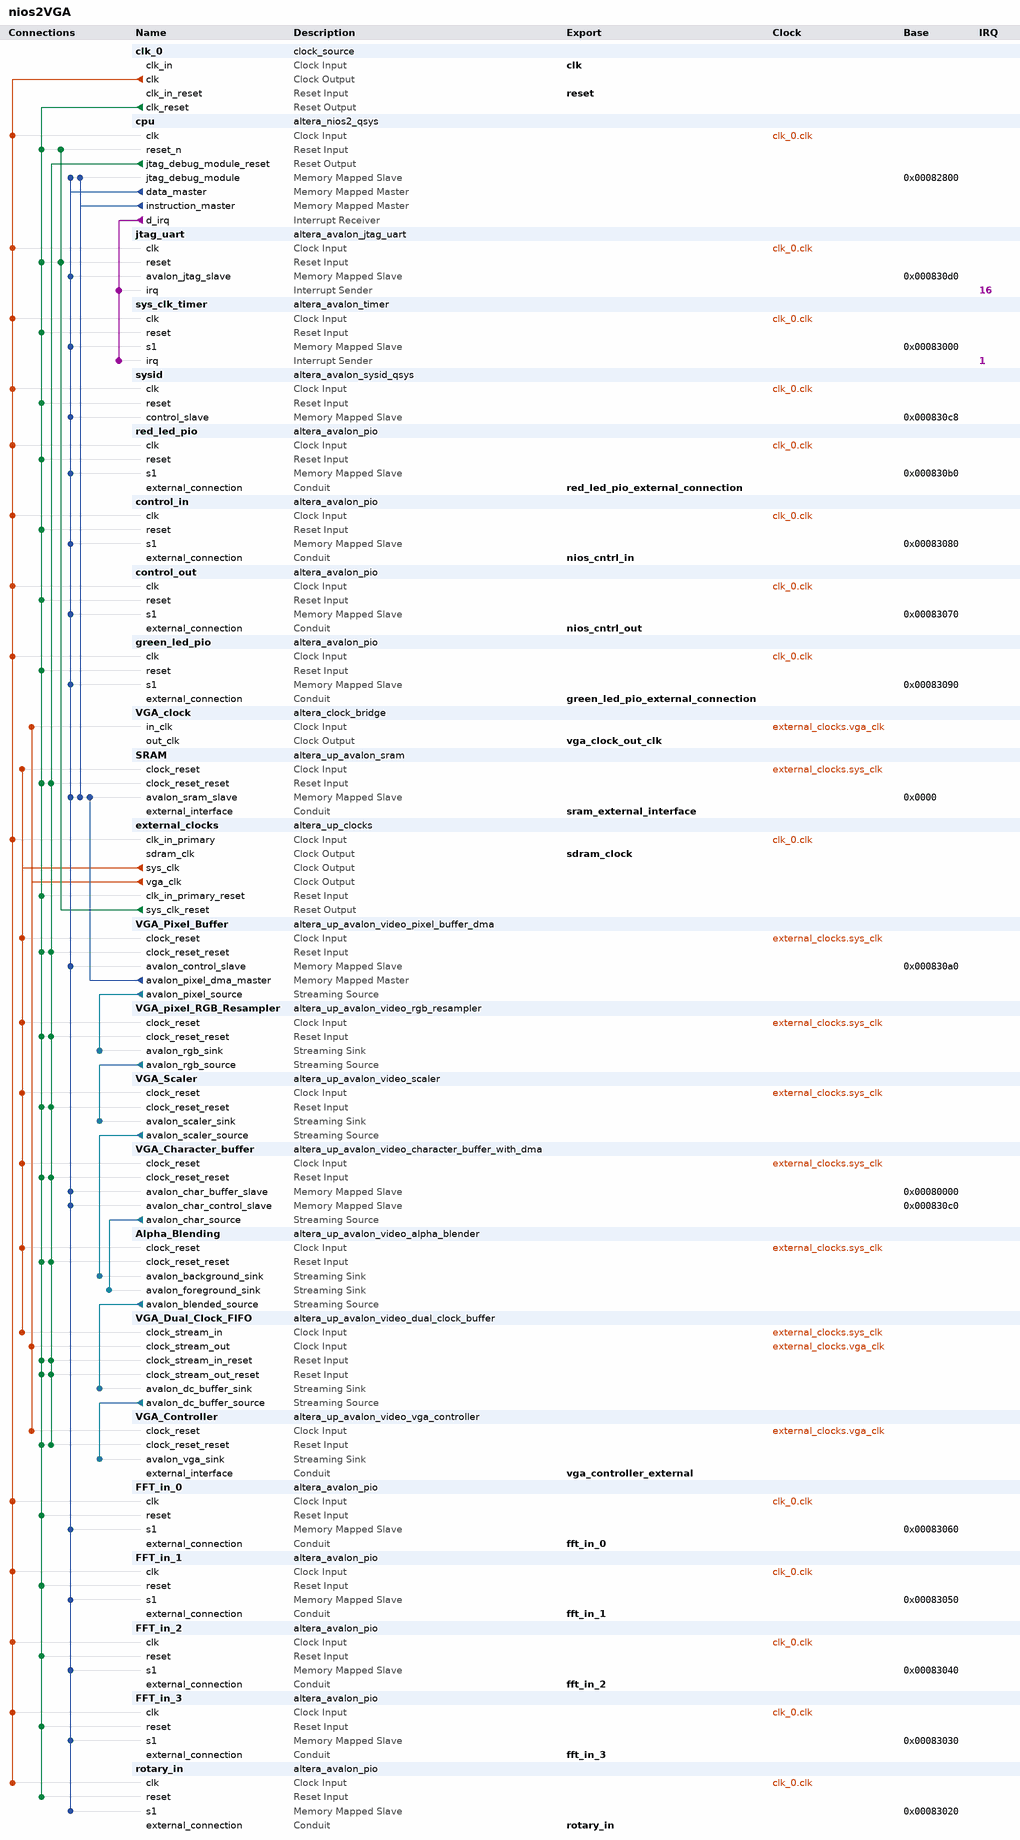
[diagram p0: system contents]
# Platform Designer (Qsys) system nios2VGA, Cyclone II EP2C35F672C6
# Parameters at their usual value, and those the tool derives, are not listed.
package require -exact qsys 13.0.1.99.2
create_system nios2VGA
set_project_property DEVICE_FAMILY {Cyclone II}
set_project_property DEVICE EP2C35F672C6

add_instance clk_0 clock_source 13.0
set_instance_parameter_value clk_0 clockFrequency 200000000

add_instance cpu altera_nios2_qsys 13.0
set_instance_parameter_value cpu resetOffset 307200
set_instance_parameter_value cpu exceptionOffset 307232
set_instance_parameter_value cpu resetSlave SRAM.avalon_sram_slave
set_instance_parameter_value cpu mmu_TLBMissExcSlave None
set_instance_parameter_value cpu exceptionSlave SRAM.avalon_sram_slave
set_instance_parameter_value cpu breakSlave cpu.jtag_debug_module
set_instance_parameter_value cpu muldiv_multiplierType NoneSmall
set_instance_parameter_value cpu impl Tiny
set_instance_parameter_value cpu icache_size 2048

add_instance jtag_uart altera_avalon_jtag_uart 13.0.1.99.2
set_instance_parameter_value jtag_uart simInteractiveOptions NO_INTERACTIVE_WINDOWS

add_instance sys_clk_timer altera_avalon_timer 13.0.1.99.2
set_instance_parameter_value sys_clk_timer period 1
set_instance_parameter_value sys_clk_timer periodUnits MSEC

add_instance sysid altera_avalon_sysid_qsys 13.0
set_instance_parameter_value sysid id 0

add_instance red_led_pio altera_avalon_pio 13.0.1.99.2
set_instance_parameter_value red_led_pio direction Output
set_instance_parameter_value red_led_pio width 18

add_instance control_in altera_avalon_pio 13.0.1.99.2
set_instance_parameter_value control_in direction Input
set_instance_parameter_value control_in width 8

add_instance control_out altera_avalon_pio 13.0.1.99.2
set_instance_parameter_value control_out direction Output
set_instance_parameter_value control_out width 8

add_instance green_led_pio altera_avalon_pio 13.0.1.99.2
set_instance_parameter_value green_led_pio direction Output
set_instance_parameter_value green_led_pio width 9

add_instance VGA_clock altera_clock_bridge 13.0
set_instance_parameter_value VGA_clock DERIVED_CLOCK_RATE 25000000
set_instance_parameter_value VGA_clock EXPLICIT_CLOCK_RATE 0

add_instance SRAM altera_up_avalon_sram 12.0
set_instance_parameter_value SRAM board DE2
set_instance_parameter_value SRAM pixel_buffer true

add_instance external_clocks altera_up_clocks 12.0
set_instance_parameter_value external_clocks board DE2
set_instance_parameter_value external_clocks vga_clk true
set_instance_parameter_value external_clocks audio_clk false
set_instance_parameter_value external_clocks audio_clk_freq 12.288

add_instance VGA_Pixel_Buffer altera_up_avalon_video_pixel_buffer_dma 12.0
set_instance_parameter_value VGA_Pixel_Buffer addr_mode Consecutive
set_instance_parameter_value VGA_Pixel_Buffer start_address 0
set_instance_parameter_value VGA_Pixel_Buffer back_start_address 153600
set_instance_parameter_value VGA_Pixel_Buffer image_width 320
set_instance_parameter_value VGA_Pixel_Buffer image_height 240
set_instance_parameter_value VGA_Pixel_Buffer color_space {16-bit RGB}

add_instance VGA_pixel_RGB_Resampler altera_up_avalon_video_rgb_resampler 12.0
set_instance_parameter_value VGA_pixel_RGB_Resampler input_type {16-bit RGB}
set_instance_parameter_value VGA_pixel_RGB_Resampler output_type {30-bit RGB}
set_instance_parameter_value VGA_pixel_RGB_Resampler alpha 1023

add_instance VGA_Scaler altera_up_avalon_video_scaler 12.0
set_instance_parameter_value VGA_Scaler width_scaling 2
set_instance_parameter_value VGA_Scaler height_scaling 2
set_instance_parameter_value VGA_Scaler width_in 320
set_instance_parameter_value VGA_Scaler color_bits 10
set_instance_parameter_value VGA_Scaler color_planes 3

add_instance VGA_Character_buffer altera_up_avalon_video_character_buffer_with_dma 12.0
set_instance_parameter_value VGA_Character_buffer enable_transparency true

add_instance Alpha_Blending altera_up_avalon_video_alpha_blender 12.0

add_instance VGA_Dual_Clock_FIFO altera_up_avalon_video_dual_clock_buffer 12.0
set_instance_parameter_value VGA_Dual_Clock_FIFO color_bits 10

add_instance VGA_Controller altera_up_avalon_video_vga_controller 12.0
set_instance_parameter_value VGA_Controller board DE2

add_instance FFT_in_0 altera_avalon_pio 13.0.1.99.2
set_instance_parameter_value FFT_in_0 direction Input
set_instance_parameter_value FFT_in_0 width 32

add_instance FFT_in_1 altera_avalon_pio 13.0.1.99.2
set_instance_parameter_value FFT_in_1 direction Input
set_instance_parameter_value FFT_in_1 width 32

add_instance FFT_in_2 altera_avalon_pio 13.0.1.99.2
set_instance_parameter_value FFT_in_2 direction Input
set_instance_parameter_value FFT_in_2 width 32

add_instance FFT_in_3 altera_avalon_pio 13.0.1.99.2
set_instance_parameter_value FFT_in_3 direction Input
set_instance_parameter_value FFT_in_3 width 32

add_instance rotary_in altera_avalon_pio 13.0.1.99.2
set_instance_parameter_value rotary_in direction Input
set_instance_parameter_value rotary_in width 8

# connections
add_connection clk_0.clk control_in.clk clock
add_connection clk_0.clk control_out.clk clock
add_connection clk_0.clk cpu.clk clock
add_connection clk_0.clk external_clocks.clk_in_primary clock
add_connection clk_0.clk FFT_in_0.clk clock
add_connection clk_0.clk FFT_in_1.clk clock
add_connection clk_0.clk FFT_in_2.clk clock
add_connection clk_0.clk FFT_in_3.clk clock
add_connection clk_0.clk green_led_pio.clk clock
add_connection clk_0.clk jtag_uart.clk clock
add_connection clk_0.clk red_led_pio.clk clock
add_connection clk_0.clk rotary_in.clk clock
add_connection clk_0.clk sys_clk_timer.clk clock
add_connection clk_0.clk sysid.clk clock
add_connection external_clocks.sys_clk Alpha_Blending.clock_reset clock
add_connection external_clocks.sys_clk SRAM.clock_reset clock
add_connection external_clocks.sys_clk VGA_Character_buffer.clock_reset clock
add_connection external_clocks.sys_clk VGA_Dual_Clock_FIFO.clock_stream_in clock
add_connection external_clocks.sys_clk VGA_Pixel_Buffer.clock_reset clock
add_connection external_clocks.sys_clk VGA_pixel_RGB_Resampler.clock_reset clock
add_connection external_clocks.sys_clk VGA_Scaler.clock_reset clock
add_connection external_clocks.vga_clk VGA_clock.in_clk clock
add_connection external_clocks.vga_clk VGA_Controller.clock_reset clock
add_connection external_clocks.vga_clk VGA_Dual_Clock_FIFO.clock_stream_out clock
add_connection clk_0.clk_reset Alpha_Blending.clock_reset_reset reset
add_connection clk_0.clk_reset control_in.reset reset
add_connection clk_0.clk_reset control_out.reset reset
add_connection clk_0.clk_reset cpu.reset_n reset
add_connection clk_0.clk_reset external_clocks.clk_in_primary_reset reset
add_connection clk_0.clk_reset FFT_in_0.reset reset
add_connection clk_0.clk_reset FFT_in_1.reset reset
add_connection clk_0.clk_reset FFT_in_2.reset reset
add_connection clk_0.clk_reset FFT_in_3.reset reset
add_connection clk_0.clk_reset green_led_pio.reset reset
add_connection clk_0.clk_reset jtag_uart.reset reset
add_connection clk_0.clk_reset red_led_pio.reset reset
add_connection clk_0.clk_reset rotary_in.reset reset
add_connection clk_0.clk_reset SRAM.clock_reset_reset reset
add_connection clk_0.clk_reset sys_clk_timer.reset reset
add_connection clk_0.clk_reset sysid.reset reset
add_connection clk_0.clk_reset VGA_Character_buffer.clock_reset_reset reset
add_connection clk_0.clk_reset VGA_Controller.clock_reset_reset reset
add_connection clk_0.clk_reset VGA_Dual_Clock_FIFO.clock_stream_in_reset reset
add_connection clk_0.clk_reset VGA_Dual_Clock_FIFO.clock_stream_out_reset reset
add_connection clk_0.clk_reset VGA_Pixel_Buffer.clock_reset_reset reset
add_connection clk_0.clk_reset VGA_pixel_RGB_Resampler.clock_reset_reset reset
add_connection clk_0.clk_reset VGA_Scaler.clock_reset_reset reset
add_connection cpu.jtag_debug_module_reset Alpha_Blending.clock_reset_reset reset
add_connection cpu.jtag_debug_module_reset SRAM.clock_reset_reset reset
add_connection cpu.jtag_debug_module_reset VGA_Character_buffer.clock_reset_reset reset
add_connection cpu.jtag_debug_module_reset VGA_Controller.clock_reset_reset reset
add_connection cpu.jtag_debug_module_reset VGA_Dual_Clock_FIFO.clock_stream_in_reset reset
add_connection cpu.jtag_debug_module_reset VGA_Dual_Clock_FIFO.clock_stream_out_reset reset
add_connection cpu.jtag_debug_module_reset VGA_Pixel_Buffer.clock_reset_reset reset
add_connection cpu.jtag_debug_module_reset VGA_pixel_RGB_Resampler.clock_reset_reset reset
add_connection cpu.jtag_debug_module_reset VGA_Scaler.clock_reset_reset reset
add_connection external_clocks.sys_clk_reset cpu.reset_n reset
add_connection external_clocks.sys_clk_reset jtag_uart.reset reset
add_connection cpu.data_master control_in.s1 avalon
set_connection_parameter_value cpu.data_master/control_in.s1 baseAddress 0x00083080
add_connection cpu.data_master control_out.s1 avalon
set_connection_parameter_value cpu.data_master/control_out.s1 baseAddress 0x00083070
add_connection cpu.data_master cpu.jtag_debug_module avalon
set_connection_parameter_value cpu.data_master/cpu.jtag_debug_module baseAddress 0x00082800
add_connection cpu.data_master FFT_in_0.s1 avalon
set_connection_parameter_value cpu.data_master/FFT_in_0.s1 baseAddress 0x00083060
add_connection cpu.data_master FFT_in_1.s1 avalon
set_connection_parameter_value cpu.data_master/FFT_in_1.s1 baseAddress 0x00083050
add_connection cpu.data_master FFT_in_2.s1 avalon
set_connection_parameter_value cpu.data_master/FFT_in_2.s1 baseAddress 0x00083040
add_connection cpu.data_master FFT_in_3.s1 avalon
set_connection_parameter_value cpu.data_master/FFT_in_3.s1 baseAddress 0x00083030
add_connection cpu.data_master green_led_pio.s1 avalon
set_connection_parameter_value cpu.data_master/green_led_pio.s1 baseAddress 0x00083090
add_connection cpu.data_master jtag_uart.avalon_jtag_slave avalon
set_connection_parameter_value cpu.data_master/jtag_uart.avalon_jtag_slave baseAddress 0x000830d0
add_connection cpu.data_master red_led_pio.s1 avalon
set_connection_parameter_value cpu.data_master/red_led_pio.s1 baseAddress 0x000830b0
add_connection cpu.data_master rotary_in.s1 avalon
set_connection_parameter_value cpu.data_master/rotary_in.s1 baseAddress 0x00083020
add_connection cpu.data_master SRAM.avalon_sram_slave avalon
set_connection_parameter_value cpu.data_master/SRAM.avalon_sram_slave baseAddress 0x0000
add_connection cpu.data_master sys_clk_timer.s1 avalon
set_connection_parameter_value cpu.data_master/sys_clk_timer.s1 baseAddress 0x00083000
add_connection cpu.data_master sysid.control_slave avalon
set_connection_parameter_value cpu.data_master/sysid.control_slave baseAddress 0x000830c8
add_connection cpu.data_master VGA_Character_buffer.avalon_char_buffer_slave avalon
set_connection_parameter_value cpu.data_master/VGA_Character_buffer.avalon_char_buffer_slave baseAddress 0x00080000
add_connection cpu.data_master VGA_Character_buffer.avalon_char_control_slave avalon
set_connection_parameter_value cpu.data_master/VGA_Character_buffer.avalon_char_control_slave baseAddress 0x000830c0
add_connection cpu.data_master VGA_Pixel_Buffer.avalon_control_slave avalon
set_connection_parameter_value cpu.data_master/VGA_Pixel_Buffer.avalon_control_slave baseAddress 0x000830a0
add_connection cpu.instruction_master cpu.jtag_debug_module avalon
set_connection_parameter_value cpu.instruction_master/cpu.jtag_debug_module baseAddress 0x00082800
add_connection cpu.instruction_master SRAM.avalon_sram_slave avalon
set_connection_parameter_value cpu.instruction_master/SRAM.avalon_sram_slave baseAddress 0x0000
add_connection VGA_Pixel_Buffer.avalon_pixel_dma_master SRAM.avalon_sram_slave avalon
set_connection_parameter_value VGA_Pixel_Buffer.avalon_pixel_dma_master/SRAM.avalon_sram_slave baseAddress 0x0000
add_connection Alpha_Blending.avalon_blended_source VGA_Dual_Clock_FIFO.avalon_dc_buffer_sink avalon_streaming
add_connection VGA_Character_buffer.avalon_char_source Alpha_Blending.avalon_foreground_sink avalon_streaming
add_connection VGA_Dual_Clock_FIFO.avalon_dc_buffer_source VGA_Controller.avalon_vga_sink avalon_streaming
add_connection VGA_Pixel_Buffer.avalon_pixel_source VGA_pixel_RGB_Resampler.avalon_rgb_sink avalon_streaming
add_connection VGA_pixel_RGB_Resampler.avalon_rgb_source VGA_Scaler.avalon_scaler_sink avalon_streaming
add_connection VGA_Scaler.avalon_scaler_source Alpha_Blending.avalon_background_sink avalon_streaming
add_connection cpu.d_irq jtag_uart.irq interrupt
set_connection_parameter_value cpu.d_irq/jtag_uart.irq irqNumber 16
add_connection cpu.d_irq sys_clk_timer.irq interrupt
set_connection_parameter_value cpu.d_irq/sys_clk_timer.irq irqNumber 1

# exported interfaces
add_interface clk clock sink
set_interface_property clk EXPORT_OF clk_0.clk_in
add_interface reset reset sink
set_interface_property reset EXPORT_OF clk_0.clk_in_reset
add_interface red_led_pio_external_connection conduit end
set_interface_property red_led_pio_external_connection EXPORT_OF red_led_pio.external_connection
add_interface vga_controller_external conduit end
set_interface_property vga_controller_external EXPORT_OF VGA_Controller.external_interface
add_interface sram_external_interface conduit end
set_interface_property sram_external_interface EXPORT_OF SRAM.external_interface
add_interface vga_clock_out_clk clock source
set_interface_property vga_clock_out_clk EXPORT_OF VGA_clock.out_clk
add_interface green_led_pio_external_connection conduit end
set_interface_property green_led_pio_external_connection EXPORT_OF green_led_pio.external_connection
add_interface sdram_clock clock source
set_interface_property sdram_clock EXPORT_OF external_clocks.sdram_clk
add_interface nios_cntrl_in conduit end
set_interface_property nios_cntrl_in EXPORT_OF control_in.external_connection
add_interface nios_cntrl_out conduit end
set_interface_property nios_cntrl_out EXPORT_OF control_out.external_connection
add_interface fft_in_0 conduit end
set_interface_property fft_in_0 EXPORT_OF FFT_in_0.external_connection
add_interface fft_in_1 conduit end
set_interface_property fft_in_1 EXPORT_OF FFT_in_1.external_connection
add_interface fft_in_2 conduit end
set_interface_property fft_in_2 EXPORT_OF FFT_in_2.external_connection
add_interface fft_in_3 conduit end
set_interface_property fft_in_3 EXPORT_OF FFT_in_3.external_connection
add_interface rotary_in conduit end
set_interface_property rotary_in EXPORT_OF rotary_in.external_connection

set_interconnect_requirement {$system} qsys_mm.clockCrossingAdapter HANDSHAKE
set_interconnect_requirement {$system} qsys_mm.maxAdditionalLatency 1

save_system nios2VGA.qsys
